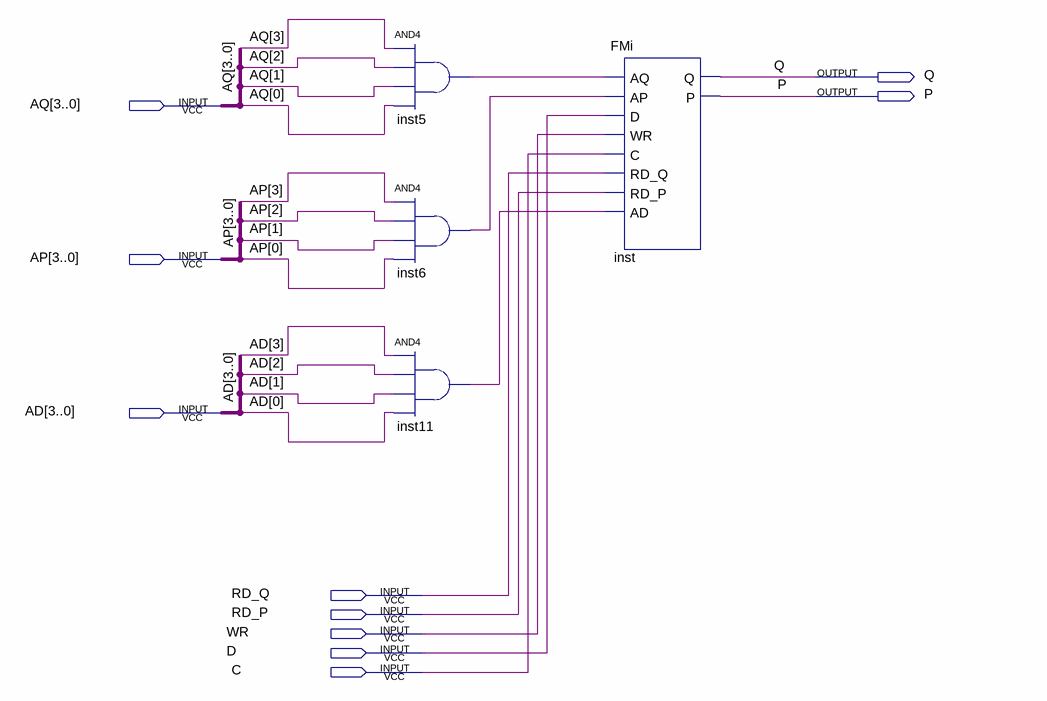
[diagram p0: schematic sheet]
// Quartus schematic FM1111.bdf as structural Verilog: 4 symbols, 10 pins
module FM1111 (
  input  [3:0] AQ,
  input  [3:0] AP,
  input  [3:0] AD,
  input  RD_Q,
  input  RD_P,
  input  WR,
  input  D,
  input  C,
  output Q,
  output P
);

  wire inst5_out, inst6_out, inst11_out;

  and inst5 (inst5_out, AQ[3], AQ[2], AQ[1], AQ[0]);
  and inst6 (inst6_out, AP[3], AP[2], AP[1], AP[0]);
  and inst11 (inst11_out, AD[3], AD[2], AD[1], AD[0]);
  FMi inst (
    .AQ(inst5_out), .AP(inst6_out), .D(D), .WR(WR), .C(C), .RD_Q(RD_Q), .RD_P(RD_P), .AD(inst11_out), .Q(Q),
    .P(P));
endmodule
